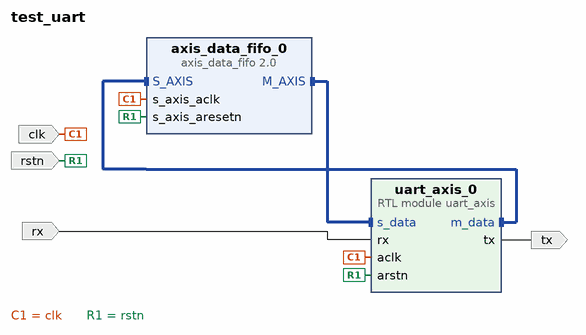
[diagram p0: block diagram of the top level]
# Vivado block design test_uart, xc7s50csga324-1, Vivado 2025.1
create_bd_design test_uart

create_bd_port -dir I -type clk clk
set_property -dict {CONFIG.FREQ_HZ 100000000} [get_bd_ports clk]
create_bd_port -dir I -type rst rstn
create_bd_port -dir I -type data rx
create_bd_port -dir O -type data tx

create_bd_cell -type module -reference uart_axis uart_axis_0
set_property -dict {CONFIG.DIVIDER 33 CONFIG.DIVIDER_WIDTH 6} [get_bd_cells uart_axis_0]
create_bd_cell -type ip -vlnv xilinx.com:ip:axis_data_fifo:2.0 axis_data_fifo_0

# ---- connections ----

connect_bd_intf_net [get_bd_intf_pins axis_data_fifo_0/M_AXIS] [get_bd_intf_pins uart_axis_0/s_data]
connect_bd_intf_net [get_bd_intf_pins axis_data_fifo_0/S_AXIS] [get_bd_intf_pins uart_axis_0/m_data]
connect_bd_net [get_bd_ports clk] [get_bd_pins axis_data_fifo_0/s_axis_aclk] [get_bd_pins uart_axis_0/aclk]
connect_bd_net [get_bd_ports rstn] [get_bd_pins axis_data_fifo_0/s_axis_aresetn] [get_bd_pins uart_axis_0/arstn]
connect_bd_net [get_bd_ports rx] [get_bd_pins uart_axis_0/rx]
connect_bd_net [get_bd_pins uart_axis_0/tx] [get_bd_ports tx]

validate_bd_design
save_bd_design
